# Altium schematic sheet USB.SchDoc
size A4
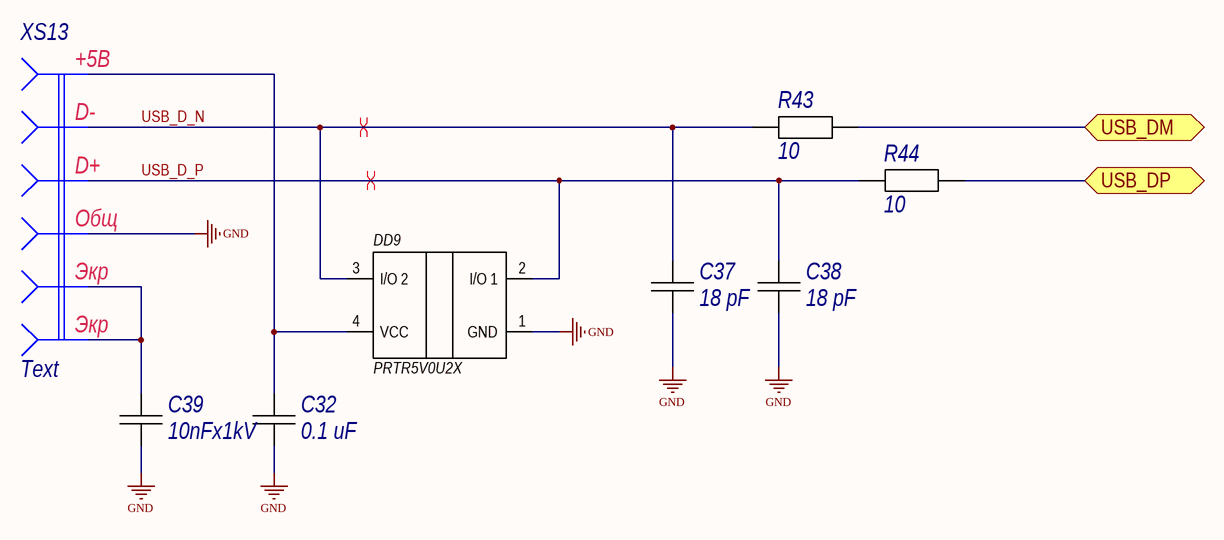
[diagram p0: USB.SchDoc]

## Parts
C32  0.1 uF  [C0805C]
C37  18 pF  [C0805C]
C38  18 pF  [C0805C]
C39  10nFx1kV  [C0805C]
DD9  PRTR5V0U2X  [SOT143B]
R43  10  [C0805R]
R44  10  [C0805R]
XS13  Text  [SAMTEC_USB-B-S-X-X-TH]

## Ports
USB_DM (bidir), USB_DP (bidir)

## Nets
GND: C32.1 C37.1 C38.1 C39.1 DD9.1(GND) XS13.4
USB_D_N: C37.2 DD9.3(I/O_2) R43.2 XS13.2
USB_D_P: C38.2 DD9.2(I/O_1) R44.2 XS13.3
USB_DM: R43.1 ; port USB_DM
USB_DP: R44.1 ; port USB_DP
NetC32_2: C32.2 DD9.4(VCC) XS13.1
NetC39_2: C39.2 XS13.S1 XS13.S2

## Layout directives
differential pair: USB_D_N, USB_D_P

## Notes on the sheet
- (in symbol CONNECT_USB) +5В; D-; D+; Общ; Экр

## Library data of the parts
C32 C37 C38 = CAP_0805: Type: Конденсатор; Published: 18.05.2010; Publisher: Andrew Danich
C39 = CAP_1206: Type: Конденсатор; Published: 18.05.2010; Publisher: Andrew Danich
DD9 = PRTR5V0U2X,215: Ultra low capacitance double rail-to-rail ESD protection diode; Package: None; MP: PRTR5V0U2X,215; Price: None; Availability: Unavailable; Value: *
R43 R44 = RES_0805: Published: 24.03.2010; Publisher: Andrew Danich; Type: Резистор
XS13 = CONNECT_USB: Published: 11.04.2016; Publisher: Andrew Danich; Type: Розетка